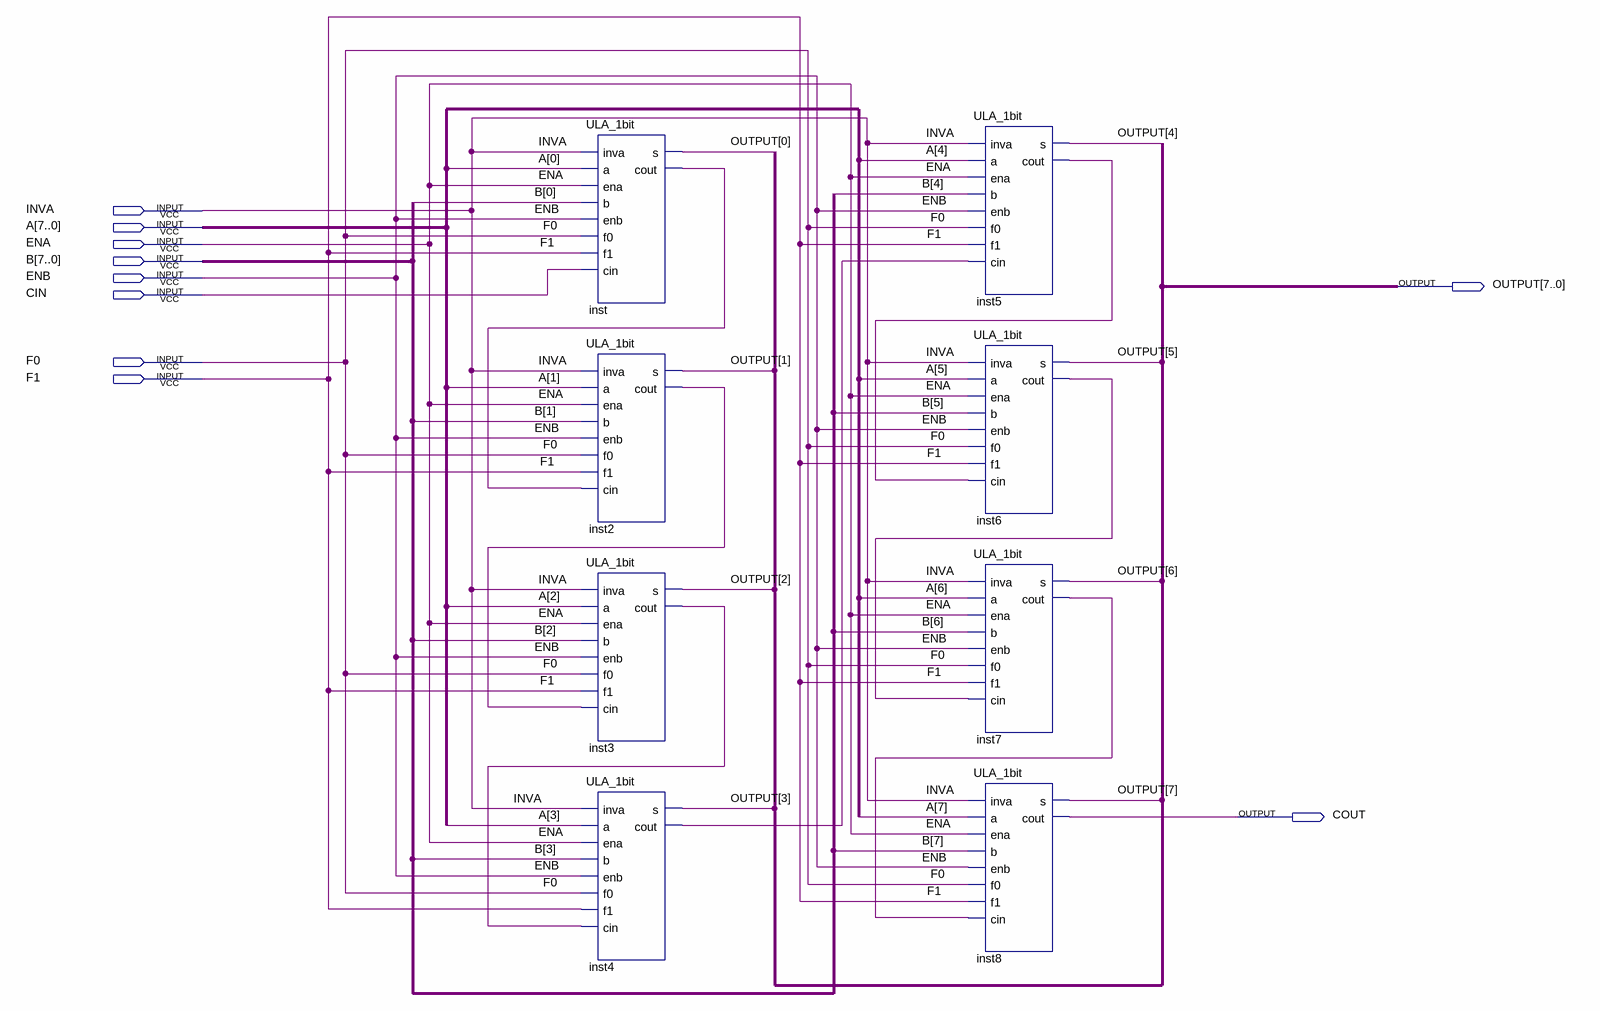
[diagram p0: schematic sheet]
// Quartus schematic ULA_8bit.bdf as structural Verilog: 8 symbols, 10 pins
module ULA_8bit (
  input  INVA,
  input  [7:0] A,
  input  ENA,
  input  [7:0] B,
  input  ENB,
  input  CIN,
  input  F0,
  input  F1,
  output [7:0] OUTPUT,
  output COUT
);

  wire inst2_cout, inst3_cout, inst4_cout, inst5_cout, inst6_cout, inst7_cout, inst_cout;

  ULA_1bit inst (
    .inva(INVA), .a(A[0]), .ena(ENA), .b(B[0]), .enb(ENB), .f0(F0), .f1(F1), .cin(CIN), .s(OUTPUT[0]),
    .cout(inst_cout));
  ULA_1bit inst2 (
    .inva(INVA), .a(A[1]), .ena(ENA), .b(B[1]), .enb(ENB), .f0(F0), .f1(F1), .cin(inst_cout), .s(OUTPUT[1]),
    .cout(inst2_cout));
  ULA_1bit inst3 (
    .inva(INVA), .a(A[2]), .ena(ENA), .b(B[2]), .enb(ENB), .f0(F0), .f1(F1), .cin(inst2_cout), .s(OUTPUT[2]),
    .cout(inst3_cout));
  ULA_1bit inst4 (
    .inva(INVA), .a(A[3]), .ena(ENA), .b(B[3]), .enb(ENB), .f0(F0), .f1(F1), .cin(inst3_cout), .s(OUTPUT[3]),
    .cout(inst4_cout));
  ULA_1bit inst5 (
    .inva(INVA), .a(A[4]), .ena(ENA), .b(B[4]), .enb(ENB), .f0(F0), .f1(F1), .cin(inst4_cout), .s(OUTPUT[4]),
    .cout(inst5_cout));
  ULA_1bit inst6 (
    .inva(INVA), .a(A[5]), .ena(ENA), .b(B[5]), .enb(ENB), .f0(F0), .f1(F1), .cin(inst5_cout), .s(OUTPUT[5]),
    .cout(inst6_cout));
  ULA_1bit inst7 (
    .inva(INVA), .a(A[6]), .ena(ENA), .b(B[6]), .enb(ENB), .f0(F0), .f1(F1), .cin(inst6_cout), .s(OUTPUT[6]),
    .cout(inst7_cout));
  ULA_1bit inst8 (
    .inva(INVA), .a(A[7]), .ena(ENA), .b(B[7]), .enb(ENB), .f0(F0), .f1(F1), .cin(inst7_cout), .s(OUTPUT[7]),
    .cout(COUT));
endmodule
